# Altium schematic sheet simplefoc-mini-native-power.SchDoc
size 193 x 117 mm
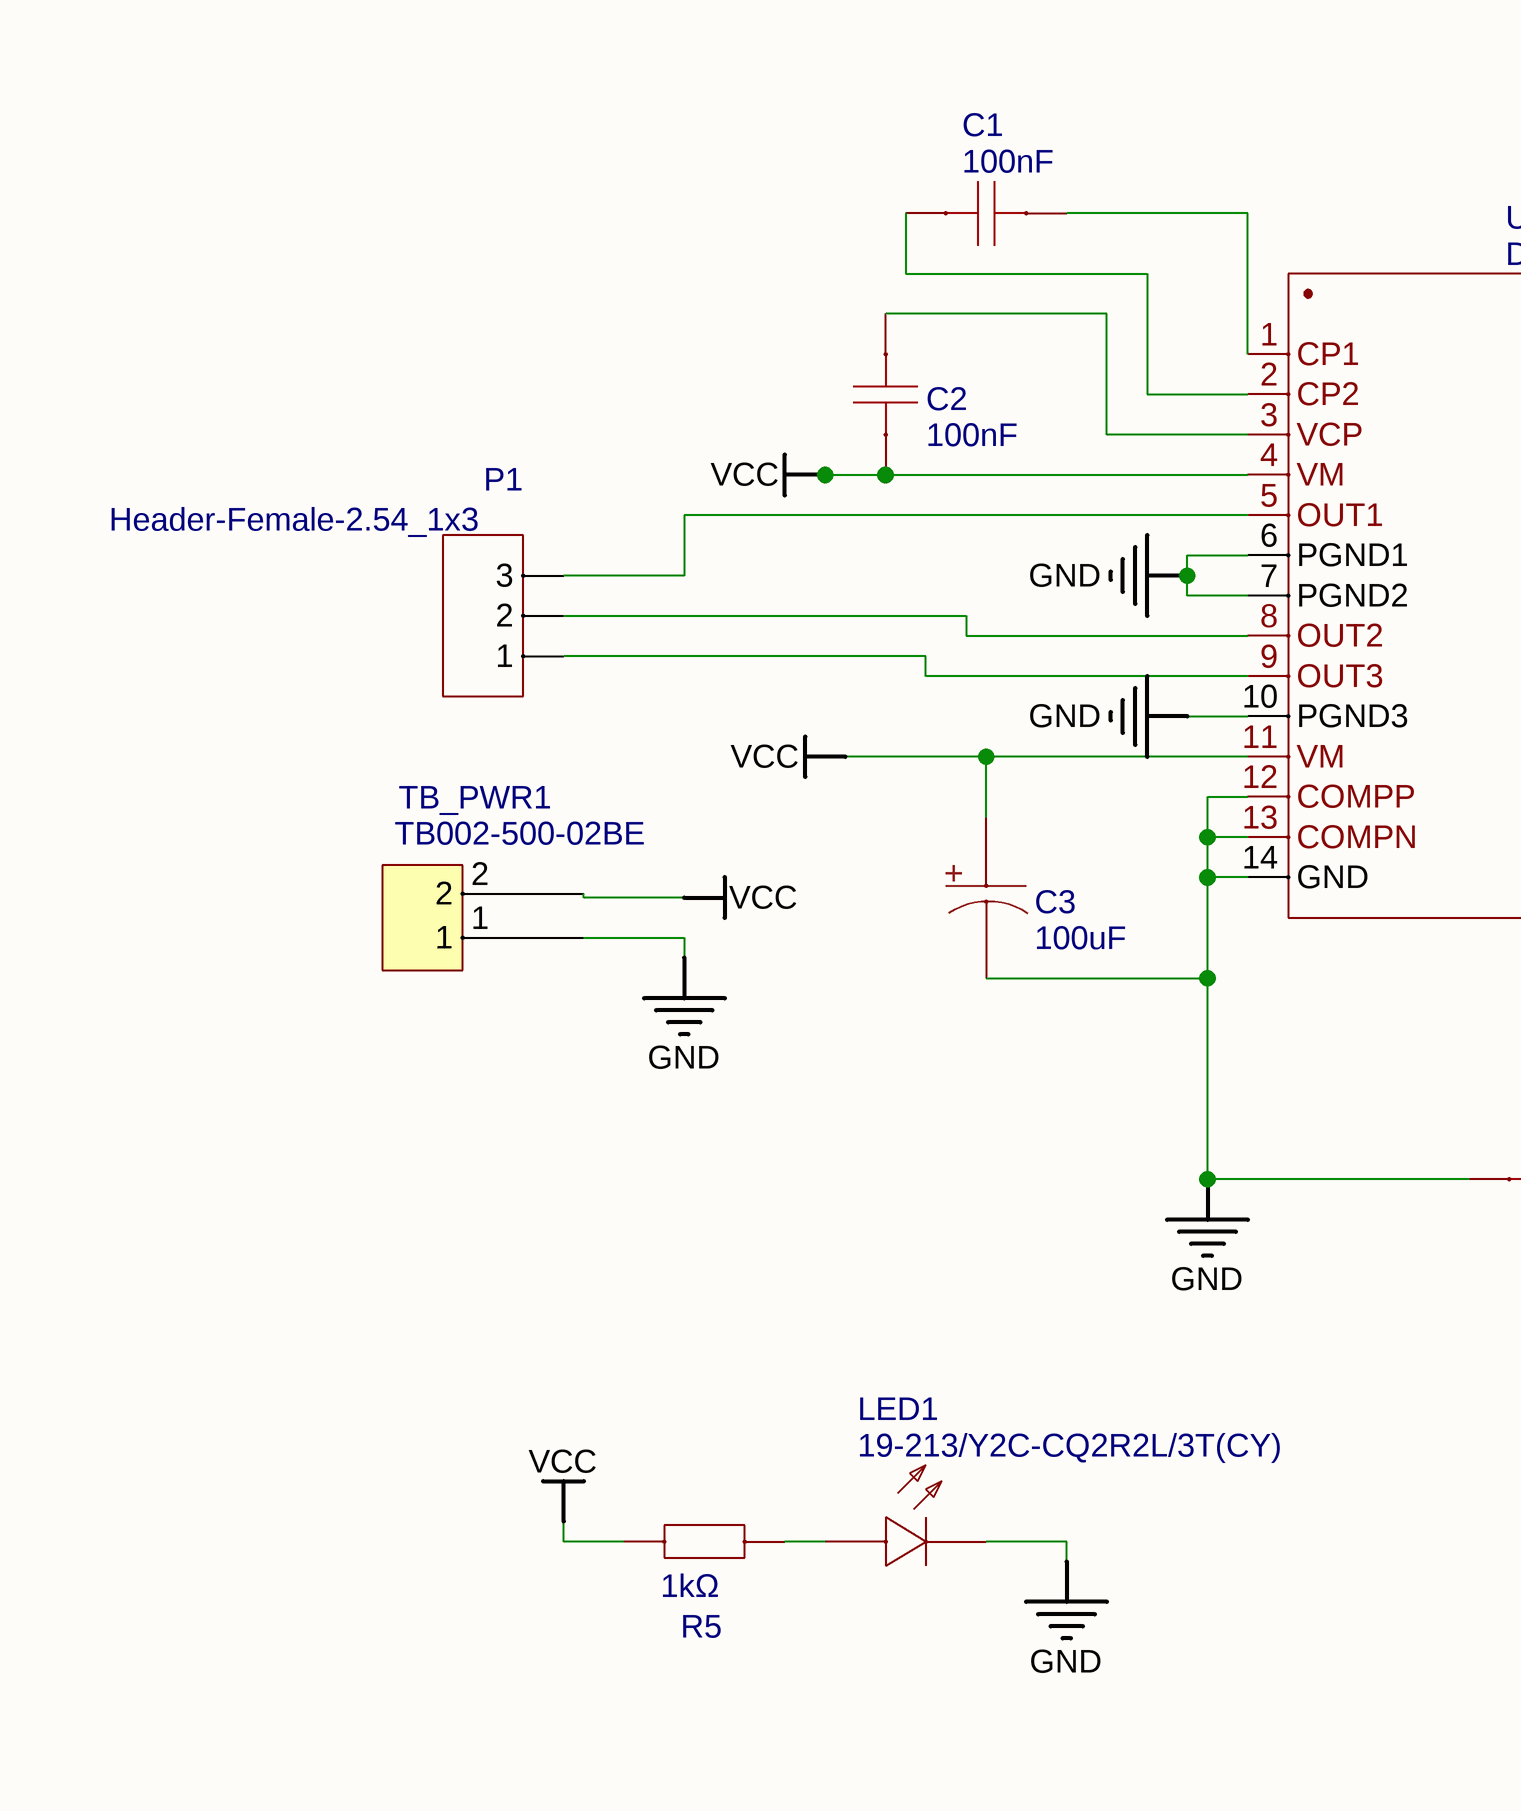
[diagram p0: simplefoc-mini-native-power.SchDoc, left]
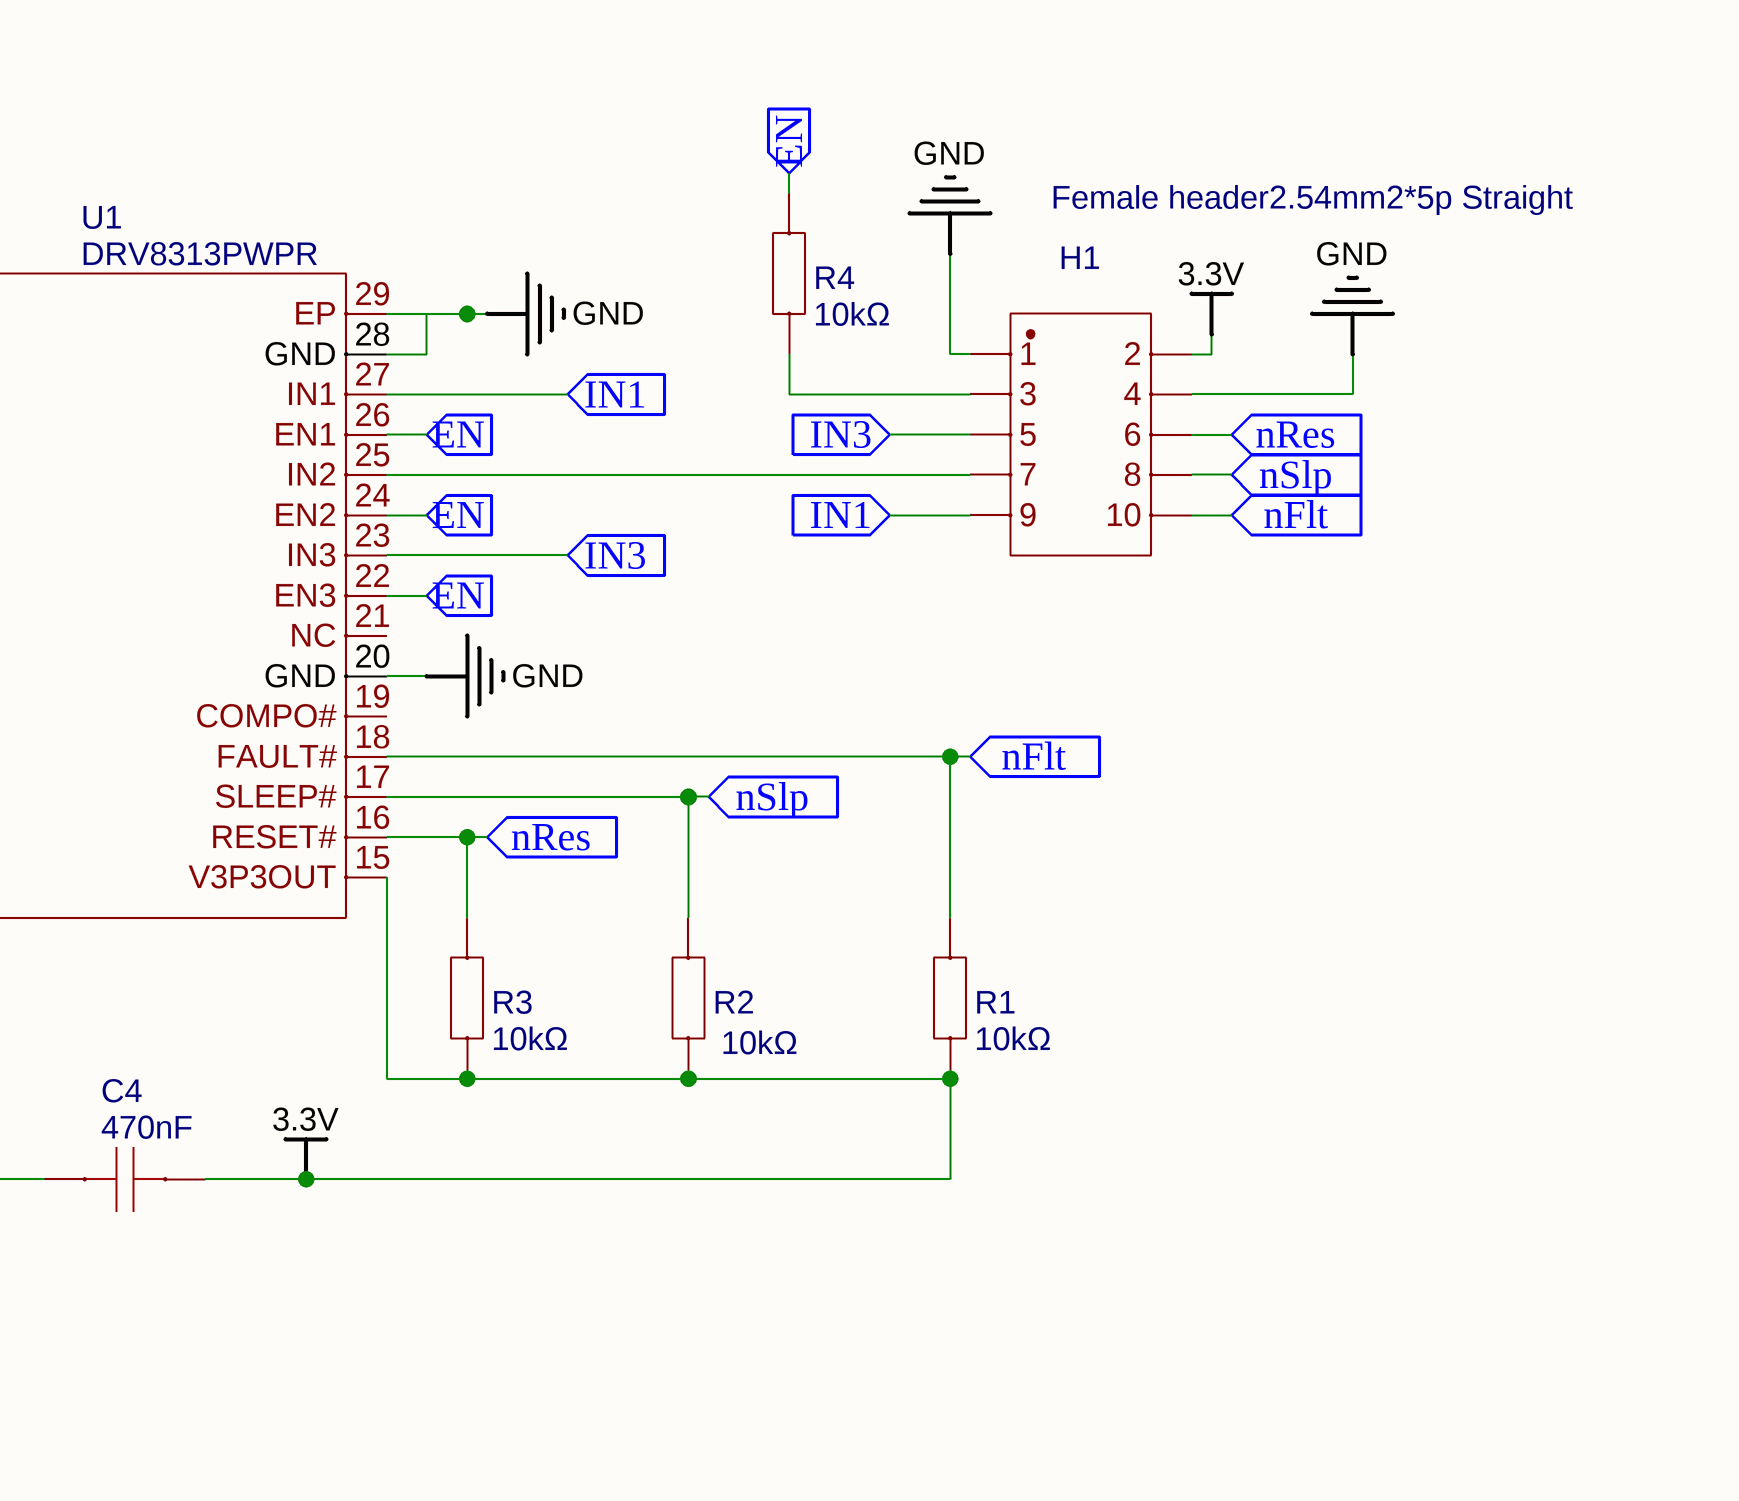
[diagram p1: simplefoc-mini-native-power.SchDoc, right]

## Parts
C1  100nF
C2  100nF
C3  100uF
C4  470nF
H1  Female header2.54mm2*5p Straight
LED1  19-213/Y2C-CQ2R2L/3T(CY)
P1  Header-Female-2.54_1x3
R1  10kΩ
R2  10kΩ
R3  10kΩ
R4  10kΩ
R5  1kΩ
TB_PWR1  TB002-500-02BE
U1  DRV8313PWPR

## Ports
EN (in), IN1 (in), IN3 (in), nFlt (in), nRes (in), nSlp (in)

## Nets
3.3V: C4.2 H1.2 R1.1 R2.1 R3.1 U1.15(V3P3OUT)
GND: C3.2 C4.1 H1.1 H1.4 LED1.2(C) TB_PWR1.1 U1.6(PGND1) U1.7(PGND2) U1.10(PGND3) U1.12(COMPP) U1.13(COMPN) U1.14(GND) U1.20(GND) U1.28(GND) U1.29(EP)
VCC: C2.1 C3.1 R5.1 TB_PWR1.2 U1.4(VM) U1.11(VM)
EN: R4.2 U1.22(EN3) U1.24(EN2) U1.26(EN1) ; port EN
IN1: H1.9 U1.27(IN1) ; port IN1
IN3: H1.5 U1.23(IN3) ; port IN3
nFlt: H1.10 R1.2 U1.18(FAULT#) ; port nFlt
nRes: H1.6 R3.2 U1.16(RESET#) ; port nRes
nSlp: H1.8 R2.2 U1.17(SLEEP#) ; port nSlp
NetC1_1: C1.1 U1.2(CP2)
NetC1_2: C1.2 U1.1(CP1)
NetC2_2: C2.2 U1.3(VCP)
NetH1_3: H1.3 R4.1
NetH1_7: H1.7 U1.25(IN2)
NetLED1_1: LED1.1(A) R5.2
NetP1_1: P1.1 U1.9(OUT3)
NetP1_2: P1.2 U1.8(OUT2)
NetP1_3: P1.3 U1.5(OUT1)

Not connected (* = marked no-connect by the designer): U1 19(COMPO#) 21(NC)